# Altium schematic sheet Hands_free_Motordrive_V1.SchDoc
size A4
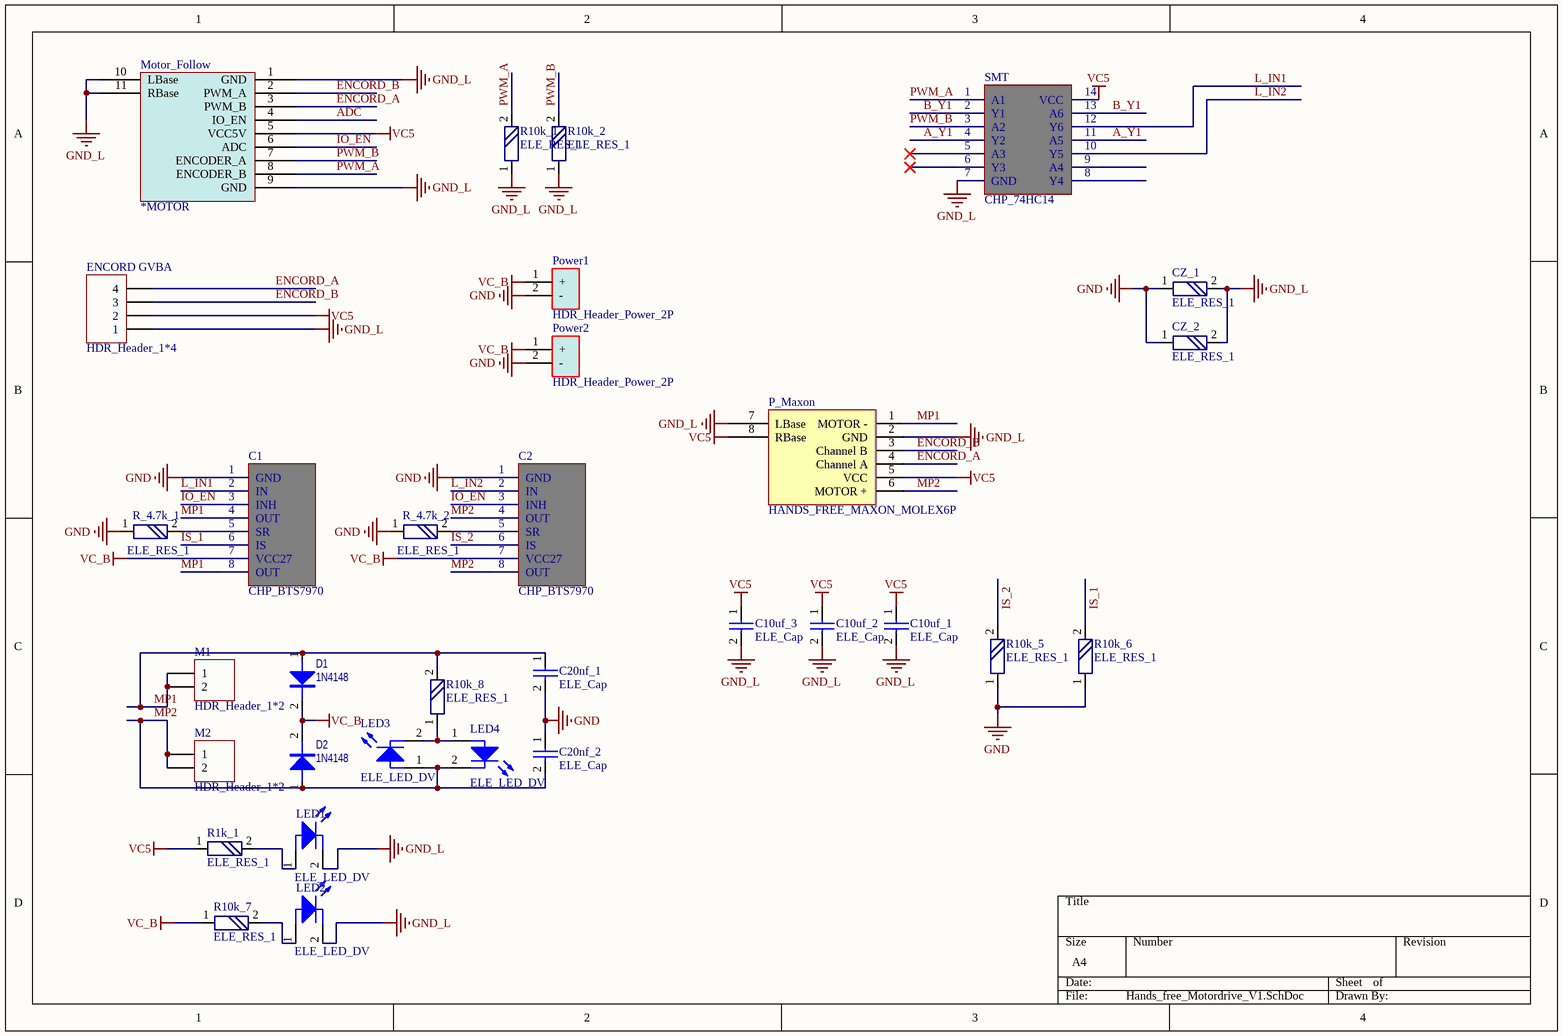
[diagram p0: Hands_free_Motordrive_V1.SchDoc]

## Parts
C1  CHP_BTS7970  [CHP_BTS7970_P-TO-263_7]
C2  CHP_BTS7970  [CHP_BTS7970_P-TO-263_7]
C10uf_1  ELE_Cap  [ELE_0603_P]
C10uf_2  ELE_Cap  [ELE_0603_P]
C10uf_3  ELE_Cap  [ELE_0603_P]
C20nf_1  ELE_Cap  [ELE_0603_P]
C20nf_2  ELE_Cap  [ELE_0603_P]
CZ_1  ELE_RES_1  [ELE_0603_P]
CZ_2  ELE_RES_1  [ELE_0603_P]
D1  1N4148  [ELE_D1206]
D2  1N4148  [ELE_D1206]
ENCORD_GVBA  HDR_Header_1*4  [HDR_Header_2.54_PH_1*4]
LED1  ELE_LED_DV  [ELE_LED_DV]
LED2  ELE_LED_DV  [ELE_LED_DV]
LED3  ELE_LED_DV  [ELE_LED_DV]
LED4  ELE_LED_DV  [ELE_LED_DV]
M1  HDR_Header_1*2  [HDR_H_PH_2P]
M2  HDR_Header_1*2  [HDR_H_PH_2P]
Motor_Follow  *MOTOR  [HDR_Molex_PH_1.25_9P]
P_Maxon  HANDS_FREE_MAXON_MOLEX6P  [HDR_Molex_PH_1.25_6P]
Power1  HDR_Header_Power_2P  [HDR_MOLEX_POWER5557_DH_2P]
Power2  HDR_Header_Power_2P  [HDR_MOLEX_POWER5557_DH_2P]
R1k_1  ELE_RES_1  [ELE_0603_P]
R10k_1  ELE_RES_1  [ELE_0603_P]
R10k_2  ELE_RES_1  [ELE_0603_P]
R10k_5  ELE_RES_1  [ELE_0603_P]
R10k_6  ELE_RES_1  [ELE_0603_P]
R10k_7  ELE_RES_1  [ELE_0603_P]
R10k_8  ELE_RES_1  [ELE_0603_P]
R_4.7k_1  ELE_RES_1  [ELE_0603_P]
R_4.7k_2  ELE_RES_1  [ELE_0603_P]
SMT  CHP_74HC14  [CHP_SOP_14P]

## Nets
GND: C1.1(GND) C2.1(GND) C20nf_1.2 C20nf_2.1 CZ_1.1 CZ_2.1 Power1.2(-) Power2.2(-) R10k_5.1 R10k_6.1 R_4.7k_1.1 R_4.7k_2.1
GND_L: C10uf_1.2 C10uf_2.2 C10uf_3.2 CZ_1.2 CZ_2.2 ENCORD_GVBA.1 LED1.2 LED2.2 Motor_Follow.1(GND) Motor_Follow.9(GND) Motor_Follow.10(LBase) Motor_Follow.11(RBase) P_Maxon.2(GND) P_Maxon.7(LBase) R10k_1.1 R10k_2.1 SMT.7(GND)
VC5: C10uf_1.1 C10uf_2.1 C10uf_3.1 ENCORD_GVBA.2 Motor_Follow.5(VCC5V) P_Maxon.5(VCC) P_Maxon.8(RBase) R1k_1.1 SMT.14(VCC)
VC_B: C1.7(VCC27) C2.7(VCC27) D1.2 D2.2 Power1.1(+) Power2.1(+) R10k_7.1
A_Y1: SMT.4(Y2) SMT.11(A5)
ADC: Motor_Follow.4(IO_EN)
B_Y1: SMT.2(Y1) SMT.13(A6)
ENCORD_A: ENCORD_GVBA.4 Motor_Follow.3(PWM_B) P_Maxon.4(Channel_A)
ENCORD_B: ENCORD_GVBA.3 Motor_Follow.2(PWM_A) P_Maxon.3(Channel_B)
IO_EN: C1.3(INH) C2.3(INH) Motor_Follow.6(ADC)
IS_1: C1.6(IS) R10k_6.2
IS_2: C2.6(IS) R10k_5.2
L_IN1: C1.2(IN) SMT.12(Y6)
L_IN2: C2.2(IN) SMT.10(Y5)
MP1: C1.4(OUT) C1.8(OUT) C20nf_1.1 D1.1 M1.1 M1.2 P_Maxon.1(MOTOR_-) R10k_8.2
MP2: C2.4(OUT) C2.8(OUT) C20nf_2.2 D2.1 LED3.1 LED4.2 M2.1 M2.2 P_Maxon.6(MOTOR_+)
PWM_A: Motor_Follow.8(ENCODER_B) R10k_1.2 SMT.1(A1)
PWM_B: Motor_Follow.7(ENCODER_A) R10k_2.2 SMT.3(A2)
NetC1_5: C1.5(SR) R_4.7k_1.2
NetC2_5: C2.5(SR) R_4.7k_2.2
NetLED1_1: LED1.1 R1k_1.2
NetLED2_1: LED2.1 R10k_7.2
NetLED3_2: LED3.2 LED4.1 R10k_8.1

Not connected (* = marked no-connect by the designer): SMT 5(A3)* 6(Y3)* 8(Y4) 9(A4)

## Library data of the parts
C10uf_1-C10uf_3 C20nf_1 C20nf_2 = ELE_Cap: 电容
CZ_1 CZ_2 R1k_1 R10k_1 R10k_2 R10k_5-R10k_8 R_4.7k_1 R_4.7k_2 = ELE_RES_1: 电阻
D1 D2 = ELE_Diode: 二极管
LED1-LED4 = ELE_LED_DV: 发光二极管 直插; Published: 8-Jun-2000; LatestRevisionDate: 17-Jul-2002; LatestRevisionNote: Re-released for DXP Platform.; PackageDocument: Feb-2002; PackageReference: 3.2X1.6X1.1; Publisher: Altium Limited
Motor_Follow = HANDS_FREE_MOTOR
SMT = CHP_74HC14: 反相施密特 7输入 SOP14
ENCORD_GVBA = HDR_Header_1*4: LatestRevisionDate: 17-Jul-2002; LatestRevisionNote: Re-released for DXP Platform.; Publisher: Altium Limited
M1 M2 = HDR_Header_1*2: LatestRevisionDate: 17-Jul-2002; LatestRevisionNote: Re-released for DXP Platform.; Publisher: Altium Limited